# Altium schematic sheet FrontEnd.SchDoc: RF Front End
size A4; Author: Lucas Liaño; Revision: 1; SheetNumber: 6; SheetTotal: 8
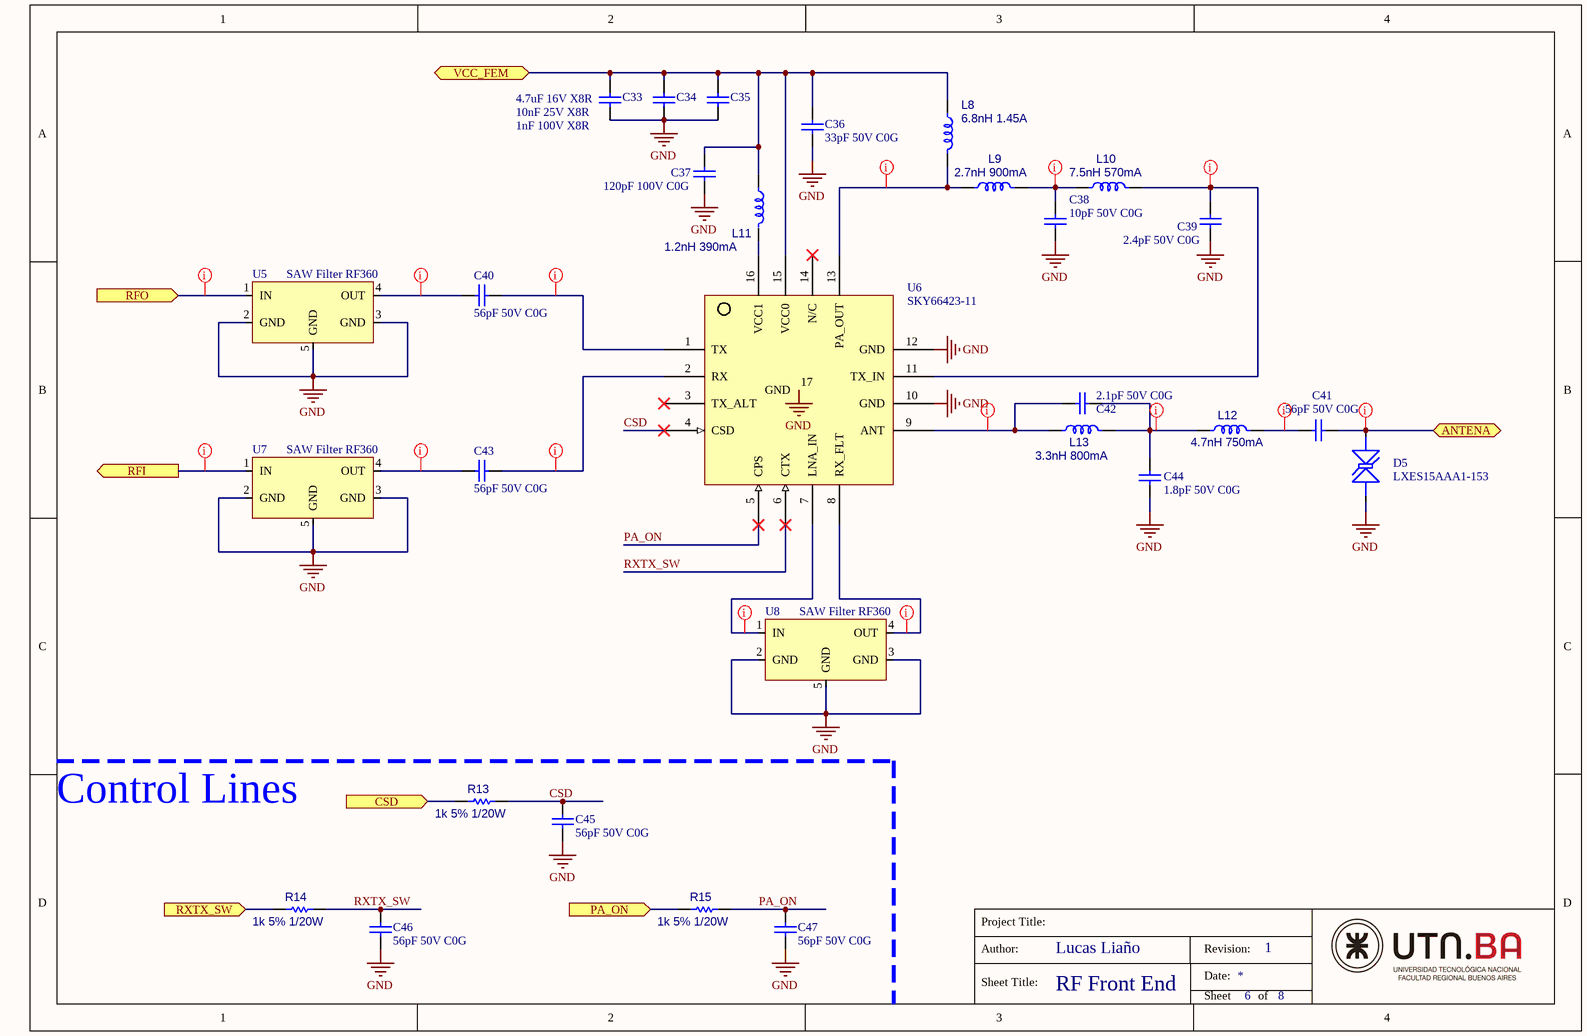
[diagram p0: FrontEnd.SchDoc]

## Parts
C33  4.7uF 16V X8R  [C_0603]
C34  10nF 25V X8R  [C_0603]
C35  1nF 100V X8R  [C_0603]
C36  33pF 50V C0G  [C_0603]
C37  120pF 100V C0G  [C_0603]
C38  10pF 50V C0G  [C_0603]
C39  2.4pF 50V C0G  [C_0603]
C40  56pF 50V C0G  [C_0603]
C41  56pF 50V C0G  [C_0603]
C42  2.1pF 50V C0G  [C_0402]
C43  56pF 50V C0G  [C_0603]
C44  1.8pF 50V C0G  [C_0603]
C45  56pF 50V C0G  [C_0603]
C46  56pF 50V C0G  [C_0603]
C47  56pF 50V C0G  [C_0603]
D5  LXES15AAA1-153  [D_0402]
L8  6.8nH 1.45A  [L_0402]
L9  2.7nH 900mA  [L_0402]
L10  7.5nH 570mA  [L_0402]
L11  1.2nH 390mA  [L_0402]
L12  4.7nH 750mA  [L_0402]
L13  3.3nH 800mA  [L_0402]
R13  1k 5% 1/20W  [0603[1608]]
R14  1k 5% 1/20W  [0603[1608]]
R15  1k 5% 1/20W  [0603[1608]]
U5  SAW Filter RF360  [QCS5P_1.4x1.1mm]
U6  SKY66423-11  [SKY66420_16P_3x3mm]
U7  SAW Filter RF360  [QCS5P_1.4x1.1mm]
U8  SAW Filter RF360  [QCS5P_1.4x1.1mm]

## Ports
ANTENA (bidir), CSD (in), PA_ON (in), RFI (out), RFO (in), RXTX_SW (in), VCC_FEM (bidir)

## Nets
GND: C33.2 C34.2 C35.2 C36.2 C37.2 C38.2 C39.2 C44.2 C45.2 C46.2 C47.2 D5.2(K) U5.2(GND) U5.3(GND) U5.5(GND) U6.10(GND) U6.12(GND) U6.17(GND) U7.2(GND) U7.3(GND) U7.5(GND) U8.2(GND) U8.3(GND) U8.5(GND)
ANTENA: C41.1 D5.1(A) ; port ANTENA
CSD: C45.1 R13.1 U6.4(CSD)
CSD: R13.2 ; port CSD  [a separate net that carries the same name]
PA_ON: C47.1 R15.1 U6.5(CPS)
PA_ON: R15.2 ; port PA_ON  [a separate net that carries the same name]
RFI: U7.1(IN) ; port RFI
RFO: U5.1(IN) ; port RFO
RXTX_SW: C46.1 R14.1 U6.6(CTX)
RXTX_SW: R14.2 ; port RXTX_SW  [a separate net that carries the same name]
VCC_FEM: C33.1 C34.1 C35.1 C36.1 C37.1 L8.1 L11.1 U6.15(VCC0) ; port VCC_FEM
NetC38_1: C38.1 L9.2 L10.1
NetC39_1: C39.1 L10.2 U6.11(TX_IN)
NetC40_1: C40.1 U5.4(OUT)
NetC40_2: C40.2 U6.1(TX)
NetC41_2: C41.2 L12.2
NetC42_1: C42.1 L13.1 U6.9(ANT)
NetC42_2: C42.2 C44.1 L12.1 L13.2
NetC43_1: C43.1 U7.4(OUT)
NetC43_2: C43.2 U6.2(RX)
NetL8_2: L8.2 L9.1 U6.13(PA_OUT)
NetL11_2: L11.2 U6.16(VCC1)
NetU6_7: U6.7(LNA_IN) U8.1(IN)
NetU6_8: U6.8(RX_FLT) U8.4(OUT)

Not connected (* = marked no-connect by the designer): U6 3(TX_ALT)* 14(N/C)*

## Layout directives
net class RF: ANTENA, NetC38_1, NetC39_1, NetC40_1, NetC40_2, NetC41_2, NetC42_1, NetC42_2, NetC43_1, NetC43_2, NetL8_2, NetU6_7, NetU6_8, RFI, RFO

## Notes on the sheet
- Control Lines
- Project Title:
- Author:
- Sheet Title:
- Date:
- Revision:
- Sheet
- of

## Library data of the parts
C33 = Cap: Capacitor; MPN: CGA5L3X8R1C475M160AB; Manufacturer: TDK Corporation; Package: 0603; Price (USD): 0.8; ComponentLink2Description: SupplierLink; ComponentLink1Description: Datasheet; ComponentLink2URL: https://www.digikey.com/es/products/detail/tdk-corporation/C3216X8R1C475K160AE/5809291; ComponentLink1URL: https://www.digikey.com/es/products/detail/tdk-corporation/C3216X8R1C475K160AE/5809291; Value: 4.7uF 16V X8R; Supplier: Digikey
C34 = Cap: Capacitor; MPN: C0603C103J3HAC7867; Manufacturer: KEMET; Package: 0603; Price (USD): 0.15; ComponentLink2Description: SupplierLink; ComponentLink1Description: Datasheet; ComponentLink2URL: https://www.digikey.com/es/products/detail/kemet/C0603C103J3HAC7867/2209299; ComponentLink1URL: https://connect.kemet.com:7667/gateway/IntelliData-ComponentDocumentation/1.0/download/datasheet/C0603C103J3HACTU; Value: 10nF 25V X8R; Supplier: Digikey
C35 = Cap: Capacitor; MPN: C0603C102J1HACAUTO; Manufacturer: KEMET; Package: 0603; Price (USD): 0.21; ComponentLink2Description: SupplierLink; ComponentLink1Description: Datasheet; ComponentLink2URL: https://www.digikey.com/es/products/detail/kemet/C0603C102J1HACAUTO/7516207; ComponentLink1URL: https://connect.kemet.com:7667/gateway/IntelliData-ComponentDocumentation/1.0/download/datasheet/C0603C102J1HACAUTO; Value: 1nF 100V X8R; Supplier: Digikey
C36 = Cap: Capacitor; MPN: GJM1555C1H330GB01; Manufacturer: Murata Electronics; Package: 0603; Price (USD): 0.21; ComponentLink2Description: SupplierLink; ComponentLink1Description: Datasheet; ComponentLink2URL: https://www.digikey.com/es/products/detail/murata-electronics/GJM1555C1H330GB01D/11618541?s=N4IgTCBcDaIOICkCyBGArBgwigEgZjwAY4AhQlEAXQF8g; ComponentLink1URL: https://search.murata.co.jp/Ceramy/image/img/A01X/G101/ENG/GJM1555C1H330GB01-01.pdf; Value: 33pF 50V C0G; Supplier: Digikey
C37 = Cap: Capacitor; MPN: GRM1555C2A121GE01; Manufacturer: Murata Electronics; Package: 0603; Price (USD): 0.1; ComponentLink2Description: SupplierLink; ComponentLink1Description: Datasheet; ComponentLink2URL: https://www.digikey.com/es/products/detail/murata-electronics/GRM1555C2A121GE01D/16033666?s=N4IgTCBcDaIOICUCyBGArBgwmAgisKcAogAwogC6AvkA; ComponentLink1URL: https://search.murata.co.jp/Ceramy/image/img/A01X/G101/ENG/GRM1555C2A121GE01-01A.pdf; Value: 120pF 100V C0G; Supplier: Digikey
C38 = Cap: Capacitor; MPN: GRM0335C1H100FA01D; Manufacturer: Murata Electronics; Package: 0603; Price (USD): 0.1; ComponentLink2Description: SupplierLink; ComponentLink1Description: Datasheet; ComponentLink2URL: https://www.digikey.com/es/products/detail/murata-electronics/GRM0335C1H100FA01D/4358087; ComponentLink1URL: https://search.murata.co.jp/Ceramy/image/img/A01X/G101/ENG/GRM0335C1H100FA01-01.pdf; Value: 10pF 50V C0G; Supplier: Digikey
C39 = Cap: Capacitor; MPN: GJM0335C1H2R4WB01; Manufacturer: Murata Electronics; Package: 0603; Price (USD): 0.1; ComponentLink2Description: SupplierLink; ComponentLink1Description: Datasheet; ComponentLink2URL: https://www.digikey.com/es/products/detail/murata-electronics/GJM0335C1H2R4WB01D/11618768?s=N4IgTCBcDaIOICkCyAGAzGgrAYQIwAkwAlAFgHUAhFXEAXQF8g; ComponentLink1URL: https://search.murata.co.jp/Ceramy/image/img/A01X/G101/ENG/GJM0335C1H2R4WB01-01.pdf; Value: 2.4pF 50V C0G; Supplier: Digikey
C40 C41 C43 C45-C47 = Cap: Capacitor; MPN: 0603J0500560KCT; Manufacturer: Knowles Syfer; Package: 0603; Price (USD): 0.1; ComponentLink2Description: SupplierLink; ComponentLink1Description: Datasheet; Value: 56pF 50V C0G; Supplier: Digikey
  C40 C46 C47: ComponentLink2URL: *; ComponentLink1URL: *
  C41 C43 C45: ComponentLink2URL: https://www.digikey.com/es/products/detail/knowles-syfer/0603J0500560KCT/6285109; ComponentLink1URL: https://www.knowlescapacitors.com/getattachment/2dbfc8bc-e2b3-4b4d-afb1-43b011b9ebe0/High-Std-Voltage.aspx
C42 = Cap: Capacitor; MPN: GJM0335C1H2R1BB01; Manufacturer: Murata Electronics; Package: 0402; Price (USD): 0.1; ComponentLink2Description: SupplierLink; ComponentLink1Description: Datasheet; ComponentLink2URL: https://www.digikey.com/es/products/detail/murata-electronics/GJM0335C1H2R1BB01D/9758981?s=N4IgTCBcDaIOICkCyAGAzGgrAYQIwAkwAlXAIVJVxAF0BfIA; ComponentLink1URL: https://search.murata.co.jp/Ceramy/image/img/A01X/G101/ENG/GJM0335C1H2R1BB01-01.pdf; Value: 2.1pF 50V C0G; Supplier: Digikey
C44 = Cap: Capacitor; MPN: GJM0335C1H1R8WB01; Manufacturer: Murata Electronics; Package: 0603; Price (USD): 0.1; ComponentLink2Description: SupplierLink; ComponentLink1Description: Datasheet; ComponentLink2URL: https://www.digikey.com/es/products/detail/murata-electronics/GJM0335C1H1R8WB01D/11618749?s=N4IgTCBcDaIOICkCyAGAzGgrAYQIwAlcAlADgHUAhFXEAXQF8g; ComponentLink1URL: https://search.murata.co.jp/Ceramy/image/img/A01X/G101/ENG/GJM0335C1H1R8WB01-01.pdf; Value: 1.8pF 50V C0G; Supplier: Digikey
D5 = TVSdiode: LXES Series - ESD Protection Device - Ultra Low Capacitance; Manufacturer: Murata Electronics; ComponentLink1Description: Datasheet; ComponentLink2Description: SupplierLink; MPN: LXES15AAA1-153; Package: 0402; Price (USD): 0.25; Supplier: Digikey; Value: LXES Series - ESD Protection Device - Ultra Low Capacitance
L8 = IND: Inductor; Manufacturer: Murata Electronics; MPN: LQW15AN6N8G80D; Package: 0402; Price (USD): 0.26; Value: 6.8nH 1.45A; ComponentLink1Description: Datasheet; ComponentLink1URL: https://search.murata.co.jp/Ceramy/image/img/P02/JELF243A-0100.pdf; ComponentLink2Description: SupplierLink; ComponentLink2URL: https://www.digikey.com/es/products/detail/murata-electronics/LQW15AN6N8G80D/4905972?s=N4IgTCBcDaIDIEUDqBGArAQQHIDYsA4BxfABgBEQBdAXyA; Supplier: Digikey
L9 = IND: Inductor; Manufacturer: Murata Electronics; MPN: LQG15WZ2N7C02D; Package: 0402; Price (USD): 0.16; Value: 2.7nH 900mA; ComponentLink1Description: Datasheet; ComponentLink1URL: https://search.murata.co.jp/Ceramy/image/img/P02/JELF243B-9117.pdf; ComponentLink2Description: SupplierLink; ComponentLink2URL: https://www.digikey.com/es/products/detail/murata-electronics/LQG15WZ2N7C02D/6798698?s=N4IgTCBcDaIDIEUDiBGArAdQFpgHIHYBhABjABEQBdAXyA; Supplier: Digikey
L10 = IND: Inductor; Manufacturer: Murata Electronics; MPN: LQW15AN7N5J00D; Package: 0402; Price (USD): 0.16; Value: 7.5nH 570mA; ComponentLink1Description: Datasheet; ComponentLink1URL: https://search.murata.co.jp/Ceramy/image/img/P02/JELF243A-0050.pdf; ComponentLink2Description: SupplierLink; ComponentLink2URL: https://www.digikey.com/es/products/detail/murata-electronics/LQW15AN7N5J00D/584352?s=N4IgTCBcDaIDIEUDqBGArAQQHIHYtoCkAGIgERAF0BfIA; Supplier: Digikey
L11 = IND: Inductor; Manufacturer: Murata Electronics; MPN: LQP15MN1N2B02; Package: 0402; Price (USD): 0.1; Value: 1.2nH 390mA; ComponentLink1Description: Datasheet; ComponentLink1URL: https://search.murata.co.jp/Ceramy/image/img/P02/JELF243C-0007.pdf; ComponentLink2Description: SupplierLink; ComponentLink2URL: https://www.digikey.com/es/products/detail/murata-electronics/LQP15MN1N2B02D/584334?s=N4IgTCBcDaIDIEUAKBGArAWQHIq2AQgAwQC6AvkA; Supplier: Digikey
L12 = IND: Inductor; Manufacturer: Murata Electronics; MPN: LQW15AN4N7C00; Package: 0402; Price (USD): 0.17; Value: 4.7nH 750mA; ComponentLink1Description: Datasheet; ComponentLink1URL: https://search.murata.co.jp/Ceramy/image/img/P02/JELF243A-0050.pdf; ComponentLink2Description: SupplierLink; ComponentLink2URL: https://www.digikey.com/es/products/detail/murata-electronics/LQW15AN4N7C00D/584348?s=N4IgTCBcDaIDIEUDqBGArAQQHIBYsHYBhABmJAF0BfIA; Supplier: Digikey
L13 = IND: Inductor; Manufacturer: Murata Electronics; MPN: LQG15HN3N3S02; Package: 0402; Price (USD): 0.1; Value: 3.3nH 800mA; ComponentLink1Description: Datasheet; ComponentLink1URL: https://search.murata.co.jp/Ceramy/image/img/P02/JELF243B-0009.pdf; ComponentLink2Description: SupplierLink; ComponentLink2URL: https://www.digikey.com/es/products/detail/murata-electronics/LQG15HN3N3S02D/2594210?s=N4IgTCBcDaIDIEUDiBGArACQHIGZcGUAGCAXQF8g; Supplier: Digikey
R13-R15 = Res: Resistor; Manufacturer: Stackpole Electronics; MPN: RMCF0201JT1K00; Package: 0603; Price (USD): 0.1; Value: 1k 5% 1/20W; ComponentLink1Description: Datasheet; ComponentLink2Description: SupplierLink; Supplier: Digikey
  R13: ComponentLink1URL: https://www.digikey.com/es/products/detail/stackpole-electronics-inc/RMCF0201JT1K00/1714962; ComponentLink2URL: https://www.digikey.com/es/products/detail/stackpole-electronics-inc/RMCF0201JT1K00/1714962
  R14 R15: ComponentLink1URL: *; ComponentLink2URL: *
U5 U7 U8 = SAW Filter RF360: Manufacturer: Qualcomm; MPN: B39921B4344P810; Value: 915MHz Frequency General Purpose RF SAW Filter (Surface Acoustic Wave) 2.8dB 26MHz Bandwidth 5-SMD, No Lead; ComponentLink1Description: Datasheet; ComponentLink2Description: SupplierLink; Package: QCS5P 1.4x1.1mm; Price (USD): 1.82; Supplier: Digikey
U6 = SKY66423-11: SKY66423-11 - 860 to 930MHz Front-End Module; Manufacturer: Skyworks Solutions; Value: RF Front End 860MHz ~ 930MHz; ComponentLink1Description: Datasheet; ComponentLink1URL: https://www.skyworksinc.com/-/media/SkyWorks/Documents/Products/2801-2900/SKY66423_11_204566J.pdf; ComponentLink2Description: SupplierLink; ComponentLink2URL: https://www.digikey.com/en/products/detail/skyworks-solutions-inc/SKY66423-11/9603432; MPN: SKY66423-11; Package: MCM-16 3x3mm; Price (USD): 3; Supplier: Digikey